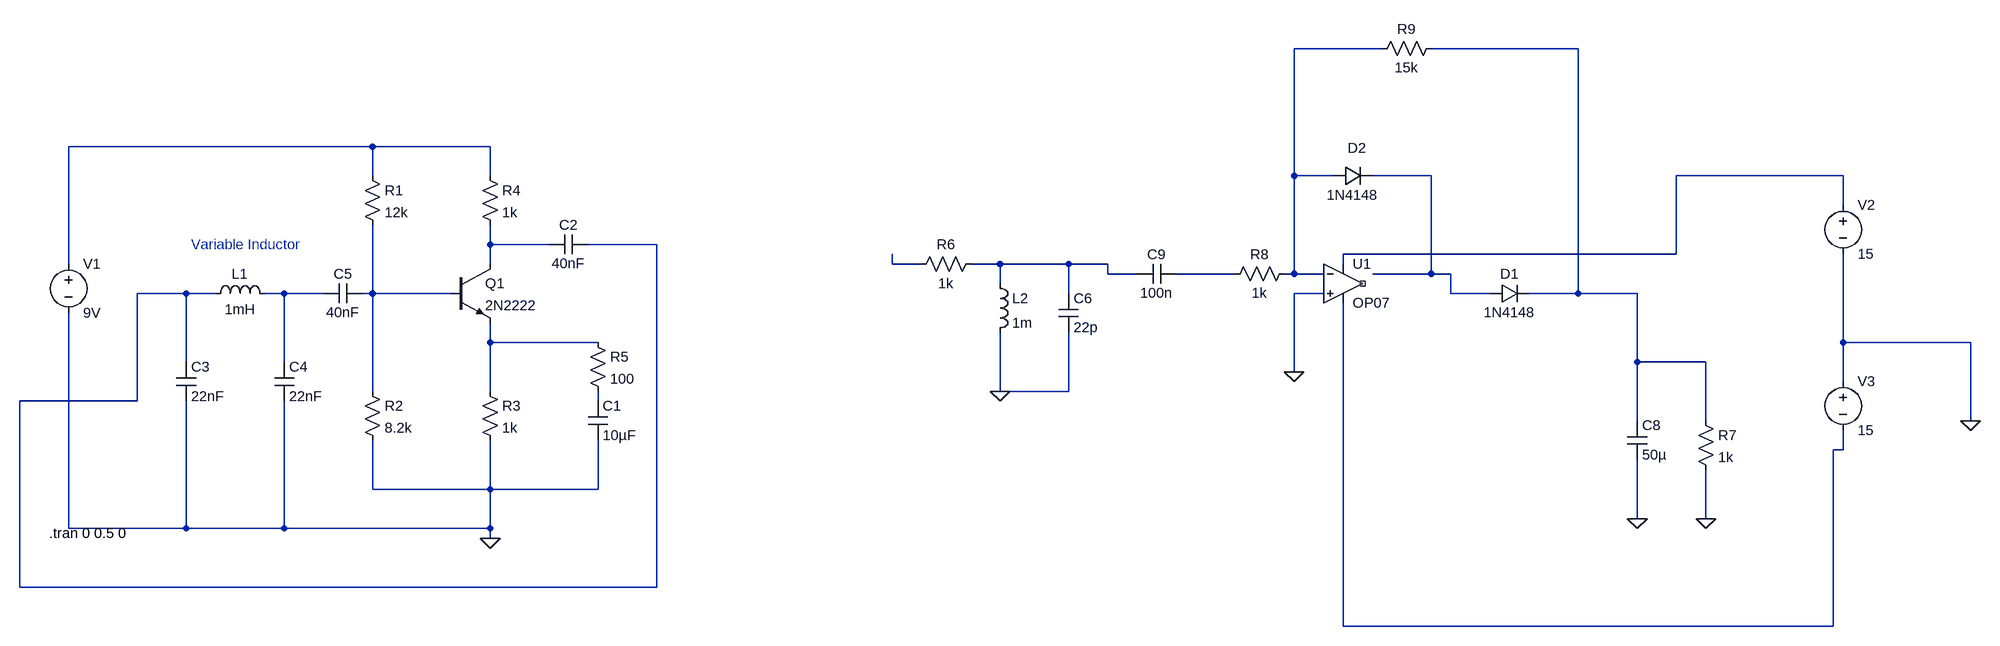
[diagram p0: schematic Draft1.asc]
Draft1.asc, the LTspice schematic file:
Version 4
SHEET 1 2868 756
WIRE 1888 -192 1744 -192
WIRE 2208 -192 1968 -192
WIRE 240 -32 -256 -32
WIRE 432 -32 240 -32
WIRE 240 16 240 -32
WIRE 432 16 432 -32
WIRE 1744 16 1744 -192
WIRE 1808 16 1744 16
WIRE 1968 16 1872 16
WIRE 2640 16 2368 16
WIRE 2640 64 2640 16
WIRE 432 128 432 96
WIRE 528 128 432 128
WIRE 704 128 592 128
WIRE 2368 144 2368 16
WIRE 2368 144 1824 144
WIRE -256 160 -256 -32
WIRE 432 160 432 128
WIRE 1088 160 1088 144
WIRE 1136 160 1088 160
WIRE 1264 160 1216 160
WIRE 1376 160 1264 160
WIRE 1440 160 1376 160
WIRE 1824 160 1824 144
WIRE 1440 176 1440 160
WIRE 1488 176 1440 176
WIRE 1648 176 1552 176
WIRE 1744 176 1744 16
WIRE 1744 176 1728 176
WIRE 1792 176 1744 176
WIRE 1968 176 1968 16
WIRE 1968 176 1872 176
WIRE 2000 176 1968 176
WIRE 1264 192 1264 160
WIRE -64 208 -144 208
WIRE -16 208 -64 208
WIRE 96 208 64 208
WIRE 160 208 96 208
WIRE 240 208 240 96
WIRE 240 208 224 208
WIRE 368 208 240 208
WIRE 1376 208 1376 160
WIRE 1792 208 1744 208
WIRE 2000 208 2000 176
WIRE 2064 208 2000 208
WIRE 2208 208 2208 -192
WIRE 2208 208 2128 208
WIRE 2304 208 2208 208
WIRE 432 288 432 256
WIRE 608 288 432 288
WIRE 2640 288 2640 144
WIRE 2848 288 2640 288
WIRE -64 320 -64 208
WIRE 96 320 96 208
WIRE 2304 320 2304 208
WIRE 2416 320 2304 320
WIRE 1744 336 1744 208
WIRE 2640 352 2640 288
WIRE 240 368 240 208
WIRE 432 368 432 288
WIRE 1264 368 1264 272
WIRE 1376 368 1376 272
WIRE 1376 368 1264 368
WIRE -144 384 -144 208
WIRE -144 384 -336 384
WIRE 608 384 608 368
WIRE 2304 416 2304 320
WIRE 2416 416 2416 320
WIRE 2848 416 2848 288
WIRE 2640 464 2640 432
WIRE 2640 464 2624 464
WIRE 240 528 240 448
WIRE 432 528 432 448
WIRE 432 528 240 528
WIRE 608 528 608 448
WIRE 608 528 432 528
WIRE 2304 576 2304 480
WIRE 2416 576 2416 496
WIRE -256 592 -256 240
WIRE -64 592 -64 384
WIRE -64 592 -256 592
WIRE 96 592 96 384
WIRE 96 592 -64 592
WIRE 432 592 432 528
WIRE 432 592 96 592
WIRE 432 608 432 592
WIRE -336 688 -336 384
WIRE 704 688 704 128
WIRE 704 688 -336 688
WIRE 1824 752 1824 224
WIRE 2624 752 2624 464
WIRE 2624 752 1824 752
FLAG 432 608 0
FLAG 1264 368 0
FLAG 2848 416 0
FLAG 2416 576 0
FLAG 2304 576 0
FLAG 1744 336 0
SYMBOL res 224 0 R0
SYMATTR InstName R1
SYMATTR Value 12k
SYMBOL res 224 352 R0
SYMATTR InstName R2
SYMATTR Value 8.2k
SYMBOL res 416 352 R0
SYMATTR InstName R3
SYMATTR Value 1k
SYMBOL npn 368 160 R0
SYMATTR InstName Q1
SYMATTR Value 2N2222
SYMBOL cap 224 192 R90
WINDOW 0 0 32 VBottom 2
WINDOW 3 32 32 VTop 2
SYMATTR InstName C5
SYMATTR Value 40nF
SYMBOL voltage -256 144 R0
WINDOW 123 0 0 Left 0
WINDOW 39 0 0 Left 0
SYMATTR InstName V1
SYMATTR Value 9V
SYMBOL res 416 0 R0
SYMATTR InstName R4
SYMATTR Value 1k
SYMBOL cap 592 112 R90
WINDOW 0 0 32 VBottom 2
WINDOW 3 32 32 VTop 2
SYMATTR InstName C2
SYMATTR Value 40nF
SYMBOL ind -32 224 R270
WINDOW 0 32 56 VTop 2
WINDOW 3 5 56 VBottom 2
SYMATTR InstName L1
SYMATTR Value 1mH
SYMBOL cap -80 320 R0
SYMATTR InstName C3
SYMATTR Value 22nF
SYMBOL cap 80 320 R0
SYMATTR InstName C4
SYMATTR Value 22nF
SYMBOL cap 592 384 R0
SYMATTR InstName C1
SYMATTR Value 10µF
SYMBOL res 592 272 R0
SYMATTR InstName R5
SYMATTR Value 100
SYMBOL res 1232 144 R90
WINDOW 0 0 56 VBottom 2
WINDOW 3 32 56 VTop 2
SYMATTR InstName R6
SYMATTR Value 1k
SYMBOL res 2400 400 R0
SYMATTR InstName R7
SYMATTR Value 1k
SYMBOL res 1744 160 R90
WINDOW 0 0 56 VBottom 2
WINDOW 3 32 56 VTop 2
SYMATTR InstName R8
SYMATTR Value 1k
SYMBOL cap 1360 208 R0
SYMATTR InstName C6
SYMATTR Value 22p
SYMBOL cap 2288 416 R0
SYMATTR InstName C8
SYMATTR Value 50µ
SYMBOL ind 1248 176 R0
SYMATTR InstName L2
SYMATTR Value 1m
SYMBOL diode 2064 224 R270
WINDOW 0 32 32 VTop 2
WINDOW 3 0 32 VBottom 2
SYMATTR InstName D1
SYMATTR Value 1N4148
SYMBOL diode 1808 32 R270
WINDOW 0 46 39 VTop 2
WINDOW 3 0 32 VBottom 2
SYMATTR InstName D2
SYMATTR Value 1N4148
SYMBOL OpAmps\\OP07 1824 128 R0
SYMATTR InstName U1
SYMBOL voltage 2640 48 R0
WINDOW 123 0 0 Left 0
WINDOW 39 0 0 Left 0
SYMATTR InstName V2
SYMATTR Value 15
SYMBOL voltage 2640 336 R0
WINDOW 123 0 0 Left 0
WINDOW 39 0 0 Left 0
SYMATTR InstName V3
SYMATTR Value 15
SYMBOL cap 1552 160 R90
WINDOW 0 0 32 VBottom 2
WINDOW 3 32 32 VTop 2
SYMATTR InstName C9
SYMATTR Value 100n
SYMBOL res 1984 -208 R90
WINDOW 0 0 56 VBottom 2
WINDOW 3 32 56 VTop 2
SYMATTR InstName R9
SYMATTR Value 15k
TEXT -288 600 Left 2 !.tran 0 0.5 0
TEXT -56 128 Left 2 ;Variable Inductor

The netlist it stands for:
* Draft1.asc
R1 N003 N012 12k
R2 N012 0 8.2k
R3 N013 0 1k
Q1 N006 N012 N013 0 2N2222
C5 N012 N011 40nF
V1 N003 0 9V
R4 N003 N006 1k
C2 N007 N006 40nF
L1 N007 N011 1mH
C3 N007 0 22nF
C4 N011 0 22nF
C1 N014 0 10µF
R5 N013 N014 100
R6 N009 N008 1k
R7 N002 0 1k
R8 N001 N010 1k
C6 N009 0 22p
C8 N002 0 50µ
L2 N009 0 1m
D1 N004 N002 1N4148
D2 N001 N004 1N4148
XU1 0 N001 N005 N015 NC_01 LT1001  ; OP07, pins In+ In- V+ V- OUT
V2 N005 0 15
V3 0 N015 15
C9 N010 N009 100n
R9 N002 N001 15k
.model D D
.lib standard.dio
.model NPN NPN
.model PNP PNP
.lib standard.bjt
.tran 0 0.5 0
* Variable Inductor
.lib LTC.lib
.backanno
.end